# Altium project Cam_HDMI.PrjPCB
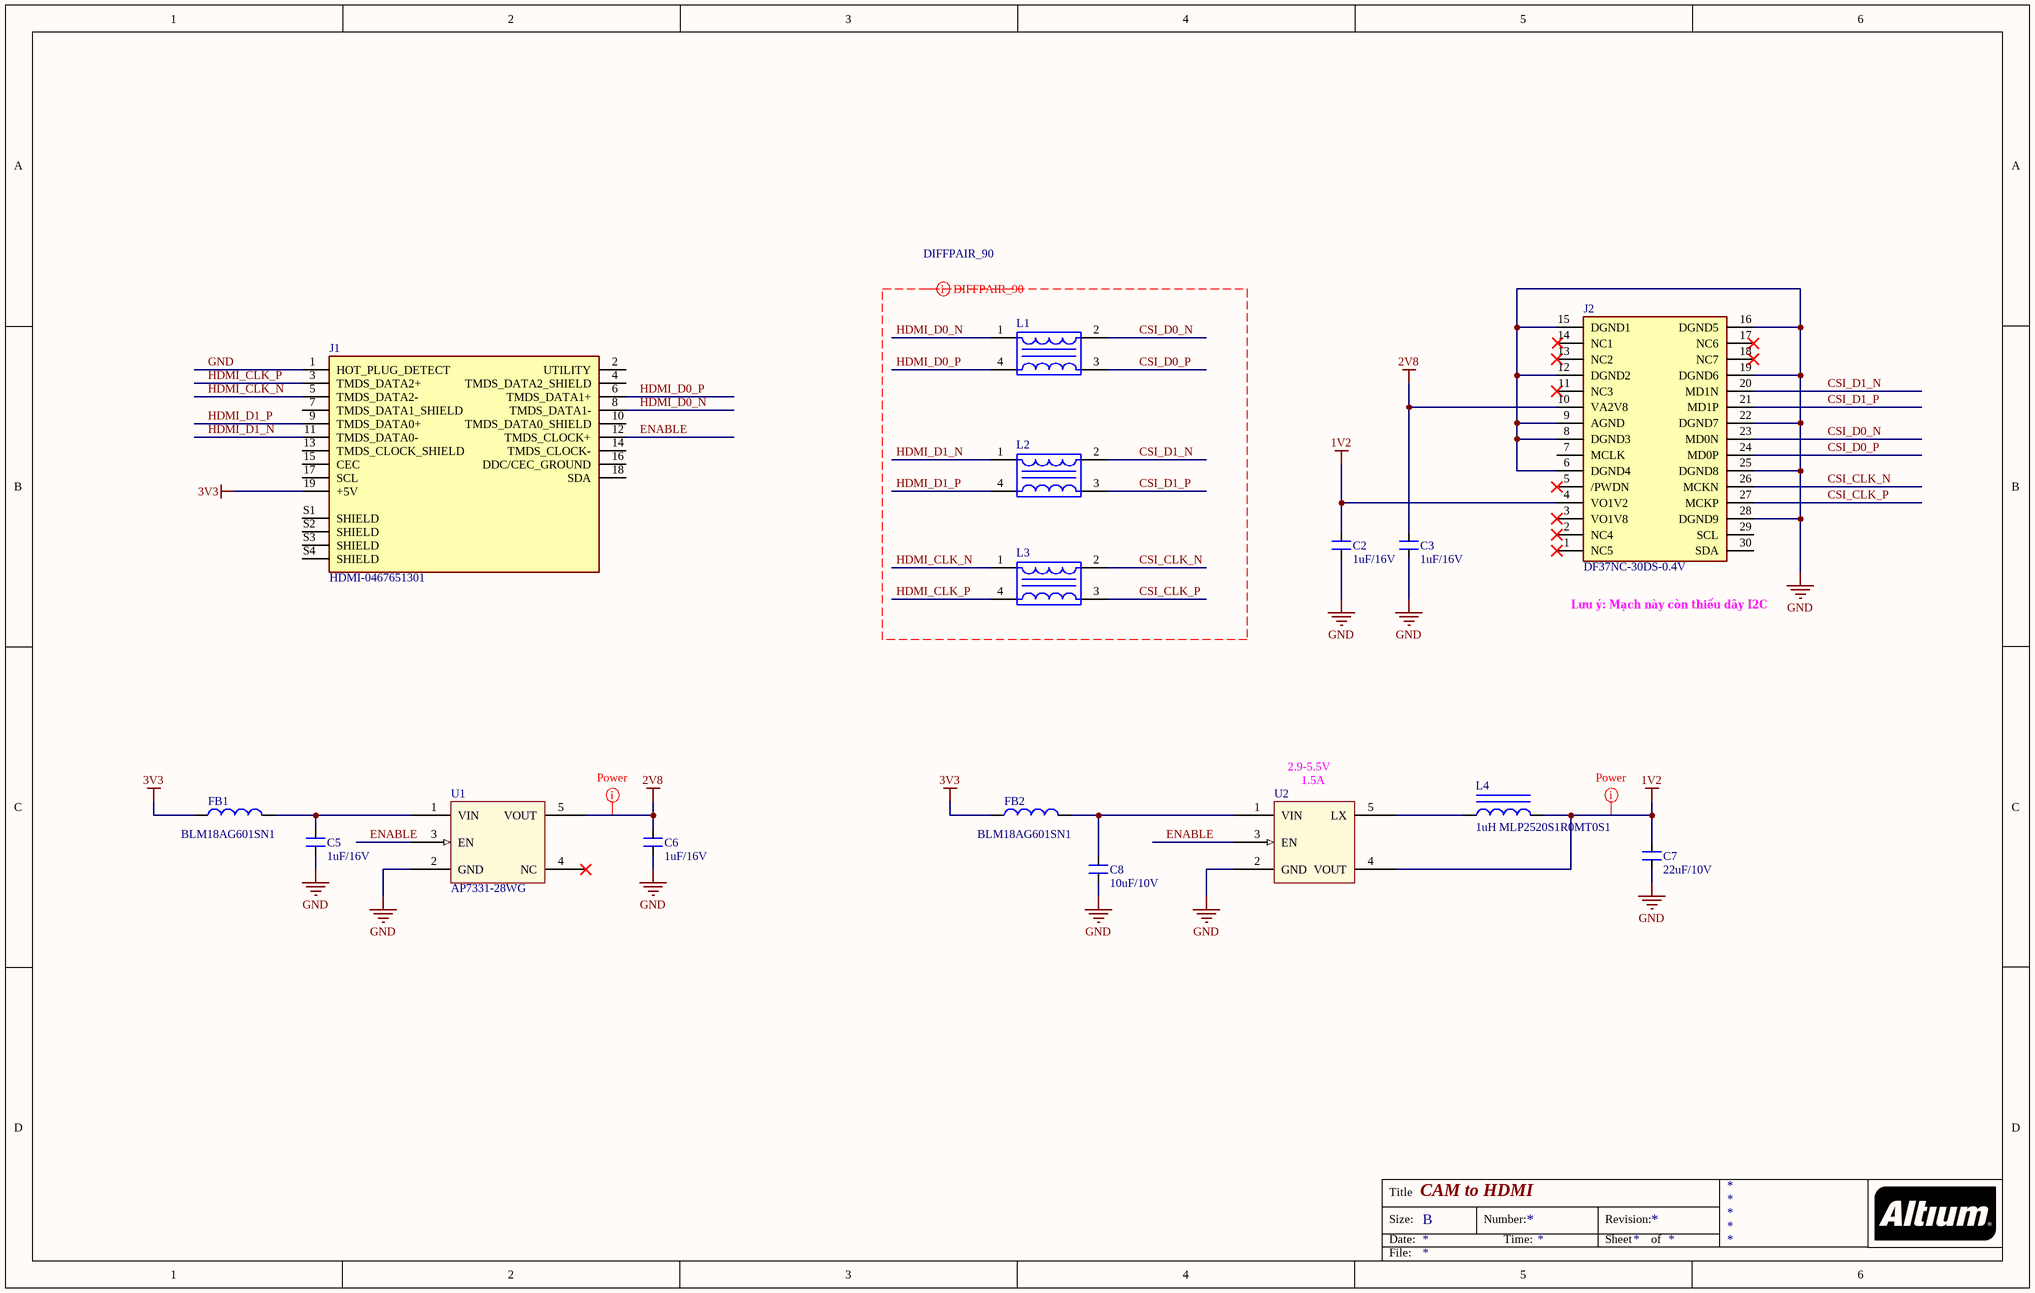
[diagram p0: Cam_HDMI.SchDoc]
1 sheet, 16 parts. Net scope: global (net labels, ports and power ports of the same name join across sheets).
Board file: Cam_HDMI.PcbDoc

## Sheet Cam_HDMI.SchDoc: CAM to HDMI
size B

### Parts
C2  1uF/16V  [CAP_CERA_C1608(CC0603INCH)]
C3  1uF/16V  [CAP_CERA_C1608(CC0603INCH)]
C5  1uF/16V  [CAP_CERA_C1608(CC0603INCH)]
C6  1uF/16V  [CAP_CERA_C1608(CC0603INCH)]
C7  22uF/10V  [CAP_CERA_C1608(CC0603INCH)]
C8  10uF/10V  [CAP_CERA_C1608(CC0603INCH)]
FB1  BLM18AG601SN1  [L0603]
FB2  BLM18AG601SN1  [L0603]
J1  HDMI-0467651301  [HDMI_MOLEX_0467650301]
J2  DF37NC-30DS-0.4V  [DF37NC-30DS-0.4V]
L1  (no value)  [DLP11SN900HL2L]
L2  (no value)  [DLP11SN900HL2L]
L3  (no value)  [DLP11SN900HL2L]
L4  1uH MLP2520S1R0MT0S1  [L 2520mm]
U1  AP7331-28WG  [SOT25]
U2  (no value)  [SOT25]

### Nets
1V2: C2.1 C7.1 J2.4(VO1V2) L4.2 U2.4(VOUT)
2V8: C3.1 C6.1 J2.10(VA2V8) U1.5(VOUT)
3V3: FB1.1 FB2.1 J1.19(+5V)
GND: C2.2 C3.2 C5.2 C6.2 C7.2 C8.2 J1.1(HOT_PLUG_DETECT) J2.6(DGND4) J2.8(DGND3) J2.9(AGND) J2.12(DGND2) J2.15(DGND1) J2.16(DGND5) J2.19(DGND6) J2.22(DGND7) J2.25(DGND8) J2.28(DGND9) U1.2(GND) U2.2(GND)
CSI_CLK_N: J2.26(MCKN) L3.2
CSI_CLK_P: J2.27(MCKP) L3.3
CSI_D0_N: J2.23(MD0N) L1.2
CSI_D0_P: J2.24(MD0P) L1.3
CSI_D1_N: J2.20(MD1N) L2.2
CSI_D1_P: J2.21(MD1P) L2.3
ENABLE: J1.12(TMDS_CLOCK+) U1.3(EN) U2.3(EN)
HDMI_CLK_N: J1.5(TMDS_DATA2-) L3.1
HDMI_CLK_P: J1.3(TMDS_DATA2+) L3.4
HDMI_D0_N: J1.8(TMDS_DATA1-) L1.1
HDMI_D0_P: J1.6(TMDS_DATA1+) L1.4
HDMI_D1_N: J1.11(TMDS_DATA0-) L2.1
HDMI_D1_P: J1.9(TMDS_DATA0+) L2.4
NetC5_1: C5.1 FB1.2 U1.1(VIN)
NetC8_1: C8.1 FB2.2 U2.1(VIN)
NetL4_1: L4.1 U2.5(LX)

Not connected (* = marked no-connect by the designer): J1 2(UTILITY) 4(TMDS_DATA2_SHIELD) 7(TMDS_DATA1_SHIELD) 10(TMDS_DATA0_SHIELD) 13(TMDS_CLOCK_SHIELD) 14(TMDS_CLOCK-) 15(CEC) 16(DDC/CEC_GROUND) 17(SCL) 18(SDA) S1(SHIELD) S2(SHIELD) S3(SHIELD) S4(SHIELD); J2 1(NC5)* 2(NC4)* 3(VO1V8)* 5(/PWDN)* 7(MCLK) 11(NC3)* 13(NC2)* 14(NC1) 17(NC6)* 18(NC7)* 29(SCL) 30(SDA); U1 4(NC)*

### Layout directives
differential pair; differential pair class DIFFPAIR_90: CSI_CLK_N, CSI_CLK_P, CSI_D0_N, CSI_D0_P, CSI_D1_N, CSI_D1_P, HDMI_CLK_N, HDMI_CLK_P, HDMI_D0_N, HDMI_D0_P, HDMI_D1_N, HDMI_D1_P
net class Power: 1V2, 2V8

### Notes on the sheet
- (near J2) Lưu ý: Mạch này còn thiếu dây I2C
- (near U2) 2.9-5.5V
- (near U2) 1.5A
- Title
- Size:
- Date:
- B
- Number:
- Time:
- Revision:
- Sheet
- of
- File:

### Library data of the parts
C2 C5-C8 = Cap Ceramic SMD: 0.1µF ±5% 16V Ceramic Capacitor X7R 0805 (2012 Metric); BuyLink: https://www.digikey.com/product-detail/en/yageo/CC0805JRX7R7BB104/311-4266-1-ND/8025355
C3 = Cap Ceramic SMD: 1µF ±10% 16V Ceramic Capacitor X7R 0603 (1608 Metric); BuyLink: https://www.digikey.com/product-detail/en/yageo/CC0805JRX7R7BB104/311-4266-1-ND/8025355
FB1 FB2 = Ferrite Bead: 600@100MHz; BuyLink: http://banlinhkien.com/cuon-cam-47uh-12x12x7mm-470-p6646214.html; LinkBuy: https://www.digikey.com/product-detail/en/bourns-inc/SRN5020-4R7M/SRN5020-4R7MCT-ND/3821535
J1 = HDMI-0467651301: HDMI - Micro Receptacle Connector 19 Position Surface Mount, Right Angle; MF: Molex; MP: 0467650301; Value: *; Package: None; Price: None; SnapEDA_Link: https://www.snapeda.com/parts/0467650301/Molex/view-part/2155824/?ref=snap; Availability: Unavailable
L1-L3 = DLP11SN900HL2L: LinkBuy: https://www.digikey.com/product-detail/en/wurth-electronics-inc/74438357015/732-11199-1-ND/6833658
L4 = CIGT252008LM2R2MNE: CIGT252008LM2R2MNE,  2.2µH2A, 2520; LinkBuy: https://www.digikey.com/product-detail/en/wurth-electronics-inc/74438357015/732-11199-1-ND/6833658
U1 = AP7331-28WG: IC REG LINEAR 2.5V 150MA SOT25; LinkBuy: https://www.mouser.vn/ProductDetail/Diodes-Incorporated/AP7115-25WG-7?qs=%2Fha2pyFadugn4DWlmzZAouPhwfrO3PcDGacmxe98LPsTsMQB%2FiMcIQ%3D%3D
U2 = SC189CSKTRT: IC REG BUCK 1.2V 1.5A TSOT23-5; LinkBuy: https://www.mouser.vn/ProductDetail/Diodes-Incorporated/AP7115-25WG-7?qs=%2Fha2pyFadugn4DWlmzZAouPhwfrO3PcDGacmxe98LPsTsMQB%2FiMcIQ%3D%3D